# EAGLE design pihat (EAGLE 7.7.0)
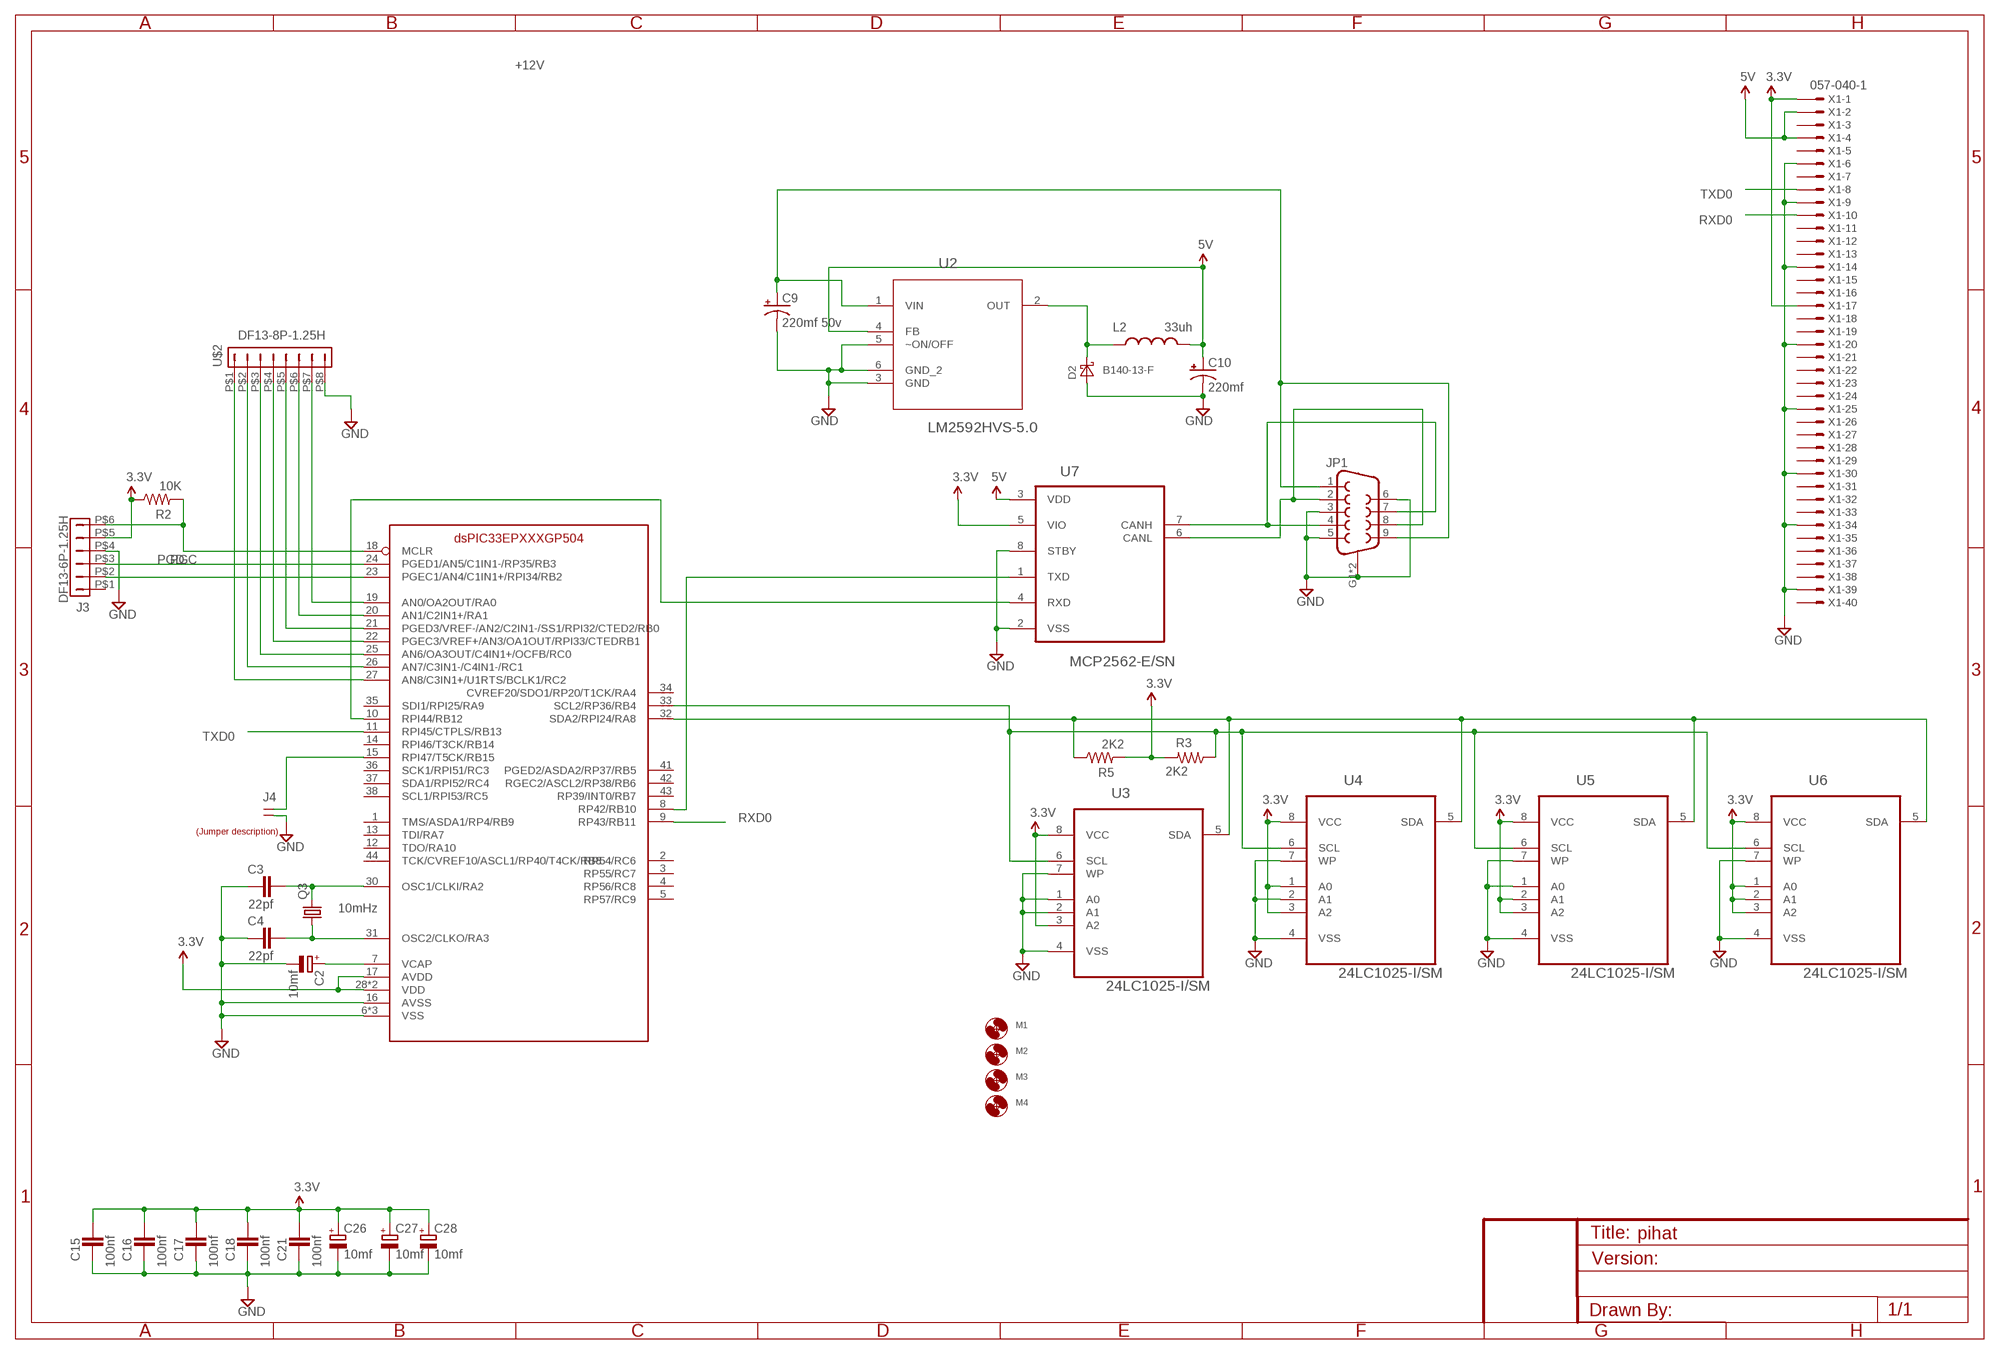
[diagram p0: schematic, sheet 1]

## Parts
C2  10mf  CAPACITOR_POL-SMC_A  [SMC_A]
C3  22pf  CAPACITOR_NPOL-0805  [C805]
C4  22pf  CAPACITOR_NPOL-0805  [C805]
C9  220mf 50v  CAP_POL7343  [EIA7343]
C10  220mf  CAP_POL7343  [EIA7343]
C15  100nf  CAPACITOR_NPOL-0805  [C805]
C16  100nf  CAPACITOR_NPOL-0805  [C805]
C17  100nf  CAPACITOR_NPOL-0805  [C805]
C18  100nf  CAPACITOR_NPOL-0805  [C805]
C21  100nf  CAPACITOR_NPOL-0805  [C805]
C26  10mf  CAPACITOR_POL-SMC_A  [SMC_A]
C27  10mf  CAPACITOR_POL-SMC_A  [SMC_A]
C28  10mf  CAPACITOR_POL-SMC_A  [SMC_A]
D2  B140-13-F  DIODE-SCHOTTKY-SMA  [SMA]
J3  DF13-6P-1.25H  [DF13A-6P-1.25H]
J4  JUMPER-1X2  [JUMPER-1X2]
JP1  DB9MALE  [DB9_MALE]
L2  33uh  INDUCTOR  [1812]
M1  MOUNT-HOLE2.8  [2,8]
M2  MOUNT-HOLE2.8  [2,8]
M3  MOUNT-HOLE2.8  [2,8]
M4  MOUNT-HOLE2.8  [2,8]
Q3  10mHz  CRYSTALHC49S  [HC49/S]
R2  10K  RESISTOR0603-RES  [0603-RES]
R3  2K2  RESISTOR0603-RES  [0603-RES]
R5  2K2  RESISTOR0603-RES  [0603-RES]
U1  DSPIC33EPXXXGP504  [TQFP44]
U2  LM2592HVS-5.0  [TO170P1435X457-5N]
U3  24LC1025-I/SM  [SOIC8-N_MC]
U4  24LC1025-I/SM  [SOIC8-N_MC]
U5  24LC1025-I/SM  [SOIC8-N_MC]
U6  24LC1025-I/SM  [SOIC8-N_MC]
U7  MCP2562-E/SN  [SOIC-8N]
U$1  LABEL_JUMPER_1X2  [JUMP2_DESC]
U$2  DF13-8P-1.25H  [DF13A-8P-1.25H]
X1  057-040-1  [057-040-1]

## Nets
3.3V: C15.1 C16.1 C17.1 C18.1 C21.1 C26.+ C27.+ C28.+ J3.P$5 R2.1 R3.2 R5.2 U1.17(AVDD) U1.28(VDD) U1.40(VDD) U3.3(A2) U3.8(VCC) U4.1(A0) U4.3(A2) U4.8(VCC) U5.2(A1) U5.3(A2) U5.8(VCC) U6.1(A0) U6.2(A1) U6.3(A2) U6.8(VCC) U7.5(VIO) X1.1 X1.17
5V: C10.A(+) L2.2 U2.4(FB) U7.3(VDD) X1.2 X1.4
!MCLR: J3.P$6 R2.2 U1.18(MCLR)
+12V [12v]: C9.A(+) JP1.1 JP1.9 U2.1(VIN)
CANH: JP1.4 JP1.7 U7.7(CANH)
CANL: JP1.2 JP1.8 U7.6(CANL)
GND: C2.- C3.2 C4.2 C9.C(-) C10.C(-) C15.2 C16.2 C17.2 C18.2 C21.2 C26.- C27.- C28.- D2.A J3.P$4 J4.2 JP1.3 JP1.5 JP1.6 JP1.G1(SHIELD) JP1.G2(SHIELD) U1.6(VSS) U1.16(AVSS) U1.29(VSS) U1.39(VSS) U2.3(GND) U2.5(~ON/OFF) U2.6(GND_2) U3.1(A0) U3.2(A1) U3.4(VSS) U3.7(WP) U4.2(A1) U4.4(VSS) U4.7(WP) U5.1(A0) U5.4(VSS) U5.7(WP) U6.4(VSS) U6.7(WP) U7.2(VSS) U7.8(STBY) U$2.P$8 X1.6 X1.9 X1.14 X1.20 X1.25 X1.30 X1.34 X1.39
N$3: U1.19(AN0/OA2OUT/RA0) U$2.P$7
N$4: U1.20(AN1/C2IN1+/RA1) U$2.P$6
N$5: U1.21(PGED3/VREF-/AN2/C2IN1-/SS1/RPI32/CTED2/RB0) U$2.P$5
N$6: U1.22(PGEC3/VREF+/AN3/OA1OUT/RPI33/CTEDRB1) U$2.P$4
N$7: U1.25(AN6/OA3OUT/C4IN1+/OCFB/RC0) U$2.P$3
N$8: U1.26(AN7/C3IN1-/C4IN1-/RC1) U$2.P$2
N$9: U1.27(AN8/C3IN1+/U1RTS/BCLK1/RC2) U$2.P$1
N$12: D2.C L2.1 U2.2(OUT)
N$19: C3.1 Q3.2 U1.30(OSC1/CLKI/RA2)
N$24: U1.10(RPI44/RB12) U7.4(RXD)
N$25: C2.+ U1.7(VCAP)
N$26: U1.8(RP42/RB10) U7.1(TXD)
N$70: C4.1 Q3.1 U1.31(OSC2/CLKO/RA3)
PGC: J3.P$2 U1.23(PGEC1/AN4/C1IN1+/RPI34/RB2)
PGD: J3.P$3 U1.24(PGED1/AN5/C1IN1-/RP35/RB3)
RESET#: J4.1 U1.15(RPI47/T5CK/RB15)
RXD0: U1.9(RP43/RB11) X1.10
SCL: R3.1 U1.33(SCL2/RP36/RB4) U3.6(SCL) U4.6(SCL) U5.6(SCL) U6.6(SCL)
SDA: R5.1 U1.32(SDA2/RPI24/RA8) U3.5(SDA) U4.5(SDA) U5.5(SDA) U6.5(SDA)
TXD0: U1.11(RPI45/CTPLS/RB13) X1.8
Unconnected: J3.P$1 U1.1(TMS/ASDA1/RP4/RB9) U1.2(RP54/RC6) U1.3(RP55/RC7) U1.4(RP56/RC8) U1.5(RP57/RC9) U1.12(TDO/RA10) U1.13(TDI/RA7) U1.14(RPI46/T3CK/RB14) U1.34(CVREF20/SDO1/RP20/T1CK/RA4) U1.35(SDI1/RPI25/RA9) U1.36(SCK1/RPI51/RC3) U1.37(SDA1/RPI52/RC4) U1.38(SCL1/RPI53/RC5) U1.41(PGED2/ASDA2/RP37/RB5) U1.42(RGEC2/ASCL2/RP38/RB6) U1.43(RP39/INT0/RB7) U1.44(TCK/CVREF10/ASCL1/RP40/T4CK/RB8) X1.3 X1.5 X1.7 X1.11 X1.12 X1.13 X1.15 X1.16 X1.18 X1.19 X1.21 X1.22 X1.23 X1.24 X1.26 X1.27 X1.28 X1.29 X1.31 X1.32 X1.33 X1.35 X1.36 X1.37 X1.38 X1.40

## Library data of the parts
C2 C26-C28 = dp_devices:CAPACITOR_POL: Polarized capacitor in various packages; PARTNO: T491A106K004AT
C3 C4 = dp_devices:CAPACITOR_NPOL: Non-Polarized capacitor in various packages; PARTNO: C0805C220J5GACTU
C9 C10 = SparkFun:CAP_POL: Capacitor Polarized These are standard SMD and PTH capacitors. Normally 10uF, 47uF, and 100uF in electrolytic and tantalum varieties. Always verify the external diameter of the through hole cap, it varies with capacity, voltage, and manufacturer. The EIA devices should be standard.
C15-C18 C21 = dp_devices:CAPACITOR_NPOL: Non-Polarized capacitor in various packages; PARTNO: CL21F104ZBCNNNC
D2 = diode2:DIODE-SCHOTTKY-: SCHOTTKY DIODE
J3 = con-hirose-df13:DF13-6P-1.25: DF13-6P 1.25mm Pitch Miniature Crimping Connector.; PARTNO: DF13A-6P-1.25H(20)
J4 = QuantumOptics:JUMPER-1X2: Jumper, header, SIP on 0.1" grid, for option selection.; PARTNO: M20-9770246
JP1 = 15pinD:DB9: DB9 Connector Standard DB9 (D-Sub 9) serial connector. Can be used for CAN bus as well as RS485 and RS232. Footprint production proven. Spark Fun Electronics SKU : PRT-00429; PROD_ID: CONN-09904
L2 = SparkFun:INDUCTOR: Inductors Basic Inductor/Choke - 0603 and 1206. Footprints are not proven and vary greatly between part numbers.
M1-M4 = tdk:MOUNT-HOLE: MOUNTING HOLE with drill center marker
Q3 = crystal:CRYSTAL: CRYSTAL; OC_FARNELL: 1667008; OC_NEWARK: unknown; PARTNO: ATS100B-E
R2 = SparkFun-Passives:RESISTOR: Resistor Basic schematic elements and footprints for 0603, 1206, and PTH resistors.; PARTNO: RC0603FR-0710KL
R3 R5 = SparkFun-Passives:RESISTOR: Resistor Basic schematic elements and footprints for 0603, 1206, and PTH resistors.; PARTNO: RC0603FR-072K2L
U1 = microchip-dspic:DSPIC33EPXXXGP504; PARTNO: DSPIC33EP512GP504-I/PT
U2 = NSC_By_element14_Batch_1.1:LM2592HVS-5.0: SIMPLE SWITCHER; MPN: LM2592HVS-5.0; OC_FARNELL: -; OC_NEWARK: 41K3791; PACKAGE: TO-263-5; SUPPLIER: National Semiconductor
U3-U6 = Microchip_By_element14_Batch_1:24LC1025-I/SM: 1024K I2C CMOS Serial EEPROM; PARTNO: 24LC1025T-I/SN
U7 = Microchip-MCP2562-E_SN:MCP2562-E/SN: High-Speed CAN Transceiver,SOIC-8; PARTNO: MCP2562-E/SN
U$1 = dp_devices:LABEL_JUMPER_1X2: Nice formatted two legged jumperdescription Use attributes to change the values ON = With jumper OFF = Without jumper; OFF: Normal; ON: Reset
U$2 = con-hirose-df13:DF13-8P-1.25: DF13-8P 1.25mm Pitch Miniature Crimping Connector.
X1 = con-panduit-changed:057-040-: CONNECTOR 40-pin series 057 contact pc board low profile headers; OC_FARNELL: unknown; OC_NEWARK: unknown

## Net classes
2 12v: width 0.152 mm, drill 0.305 mm, clearance 0.305 mm

## Board
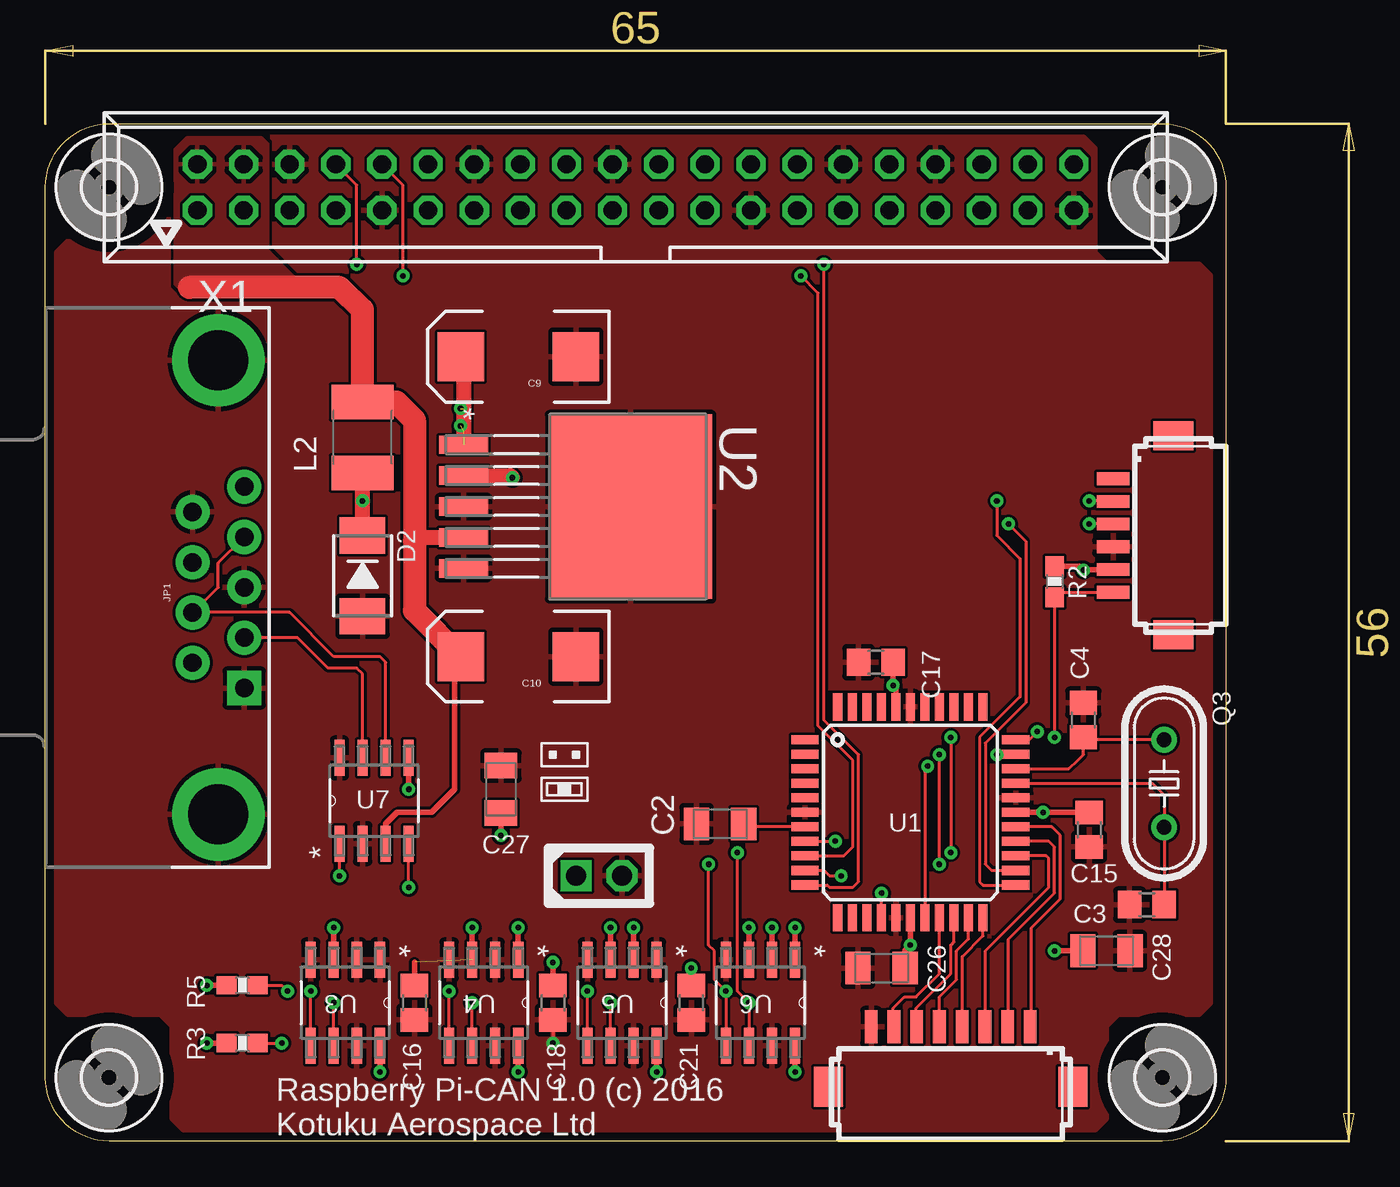
[diagram p1: board, top side]
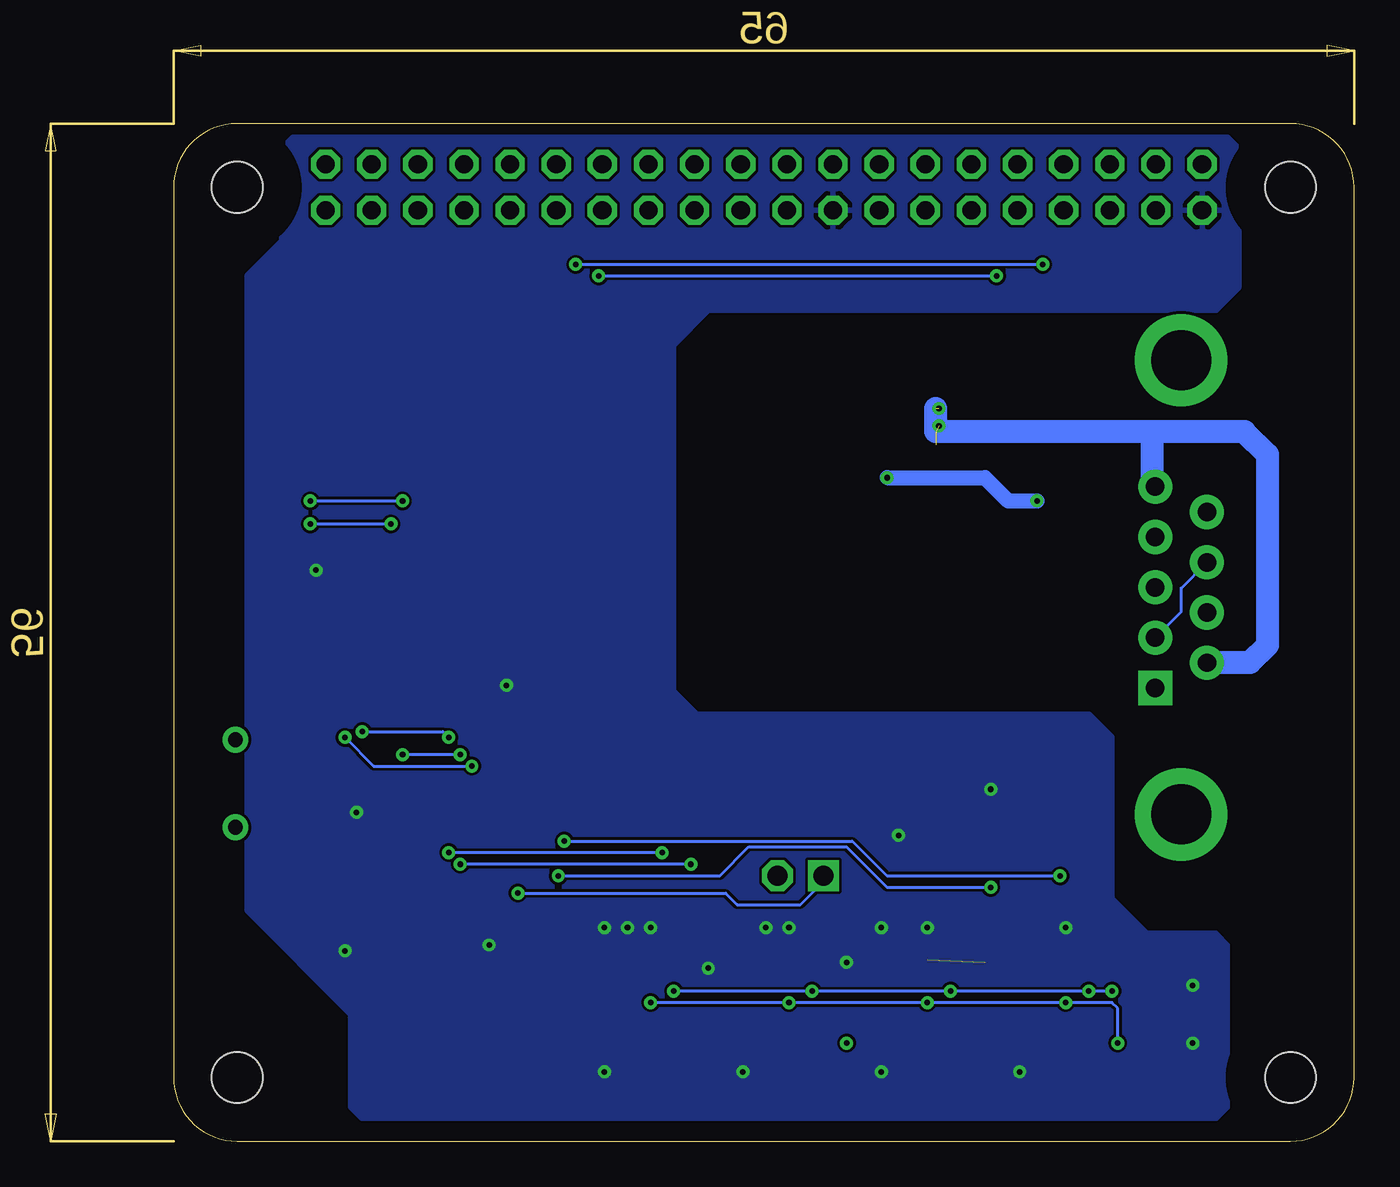
[diagram p2: board, bottom side, seen from below]

Size 65 x 56 mm. Coordinates in mm from the lower left corner, seen from the top.
Outline: 0,3.5 0,52.5 arc-90 3.5,56 61.5,56 arc-90 65,52.5 65,3.5 arc-90 61.5,0 3.5,0 arc-90 0,3.5
Copper layers (1*16): Top 0.035mm / dielectric 1.5mm / Bottom 0.035mm
Design rules "DFRobot_Eagle_Rule_v0.4": minimum track width 6mil, minimum drill 12mil, track to track 6mil, track to pad 6mil, pad to pad 6mil, via to via 6mil, smd to smd 0mil, copper to edge 10mil, drill to drill 10mil, minimum pad ring 12mil, minimum via ring 8mil, stop-mask expansion 2mil, vias tented up to drill 25mil, thermal gap 10mil

### Footprints (pad centres in the part's own frame; a part is rotated, then mirrored left to right if it is on the bottom)
SMC_A = smd 1.4 x 1.8: + -1.3,0; - 1.3,0
C805 = smd 1.3 x 1.5: 1 -0.95,0; 2 0.95,0
EIA7343 = smd 2.55 x 2.7: A 3.17,0; C -3.17,0
SMA = smd 2 x 2.5: A 2.223,0; C -2.223,0
DF13A-6P-1.25H = smd 1.6 x 2.2: M$0 -5.475,2.4; M$1 5.475,2.4 | smd 0.7 x 1.8: P$1 -3.125,-0.9; P$2 -1.875,-0.9; P$3 -0.625,-0.9; P$4 0.625,-0.9; P$5 1.875,-0.9; P$6 3.125,-0.9
JUMPER-1X2 = drill 1.092 square: 1 0,2.54 | drill 1.092 octagon: 2 0,0
DB9_MALE = drill 1.016 pad 1.88: 1 5.54,-1.42; 2 2.77,-1.42; 3 0,-1.42; 4 -2.77,-1.42; 6 4.15,1.42; 7 1.38,1.42; 8 -1.38,1.42; 9 -4.15,1.42 | drill 1.016 pad 1.88 square: 5 -5.54,-1.42 | drill 3.302 pad 5.08: G1 -12.5,0; G2 12.5,0
1812 = smd 1.9 x 3.4: 1 -1.95,0; 2 1.95,0
2,8 = hole 2.8: 0,0
HC49/S = drill 0.813: 1 -2.413,0; 2 2.413,0
0603-RES = smd 1.1 x 1: 1 -0.85,0; 2 0.85,0
TQFP44 = smd 1.5 x 0.5: 1 -5.8,4; 2 -5.8,3.2; 3 -5.8,2.4; 4 -5.8,1.6; 5 -5.8,0.8; 6 -5.8,0; 7 -5.8,-0.8; 8 -5.8,-1.6; 9 -5.8,-2.4; 10 -5.8,-3.2; 11 -5.8,-4; 23 5.8,-4; 24 5.8,-3.2; 25 5.8,-2.4; 26 5.8,-1.6; 27 5.8,-0.8; 28 5.8,0; 29 5.8,0.8; 30 5.8,1.6; 31 5.8,2.4; 32 5.8,3.2; 33 5.8,4 | smd 0.5 x 1.5: 12 -4,-5.8; 13 -3.2,-5.8; 14 -2.4,-5.8; 15 -1.6,-5.8; 16 -0.8,-5.8; 17 0,-5.8; 18 0.8,-5.8; 19 1.6,-5.8; 20 2.4,-5.8; 21 3.2,-5.8; 22 4,-5.8; 34 4,5.8; 35 3.2,5.8; 36 2.4,5.8; 37 1.6,5.8; 38 0.8,5.8; 39 0,5.8; 40 -0.8,5.8; 41 -1.6,5.8; 42 -2.4,5.8; 43 -3.2,5.8; 44 -4,5.8
TO170P1435X457-5N = smd 1.016 x 2.692: 1 -3.404,-9.042; 2 -1.702,-9.042; 3 0,-9.042; 4 1.702,-9.042; 5 3.404,-9.042 | smd 10.16 x 8.941: 6 0,0.152
SOIC8-N_MC = smd 1.981 x 0.559: 1 -2.362,1.905; 2 -2.362,0.635; 3 -2.362,-0.635; 4 -2.362,-1.905; 5 2.362,-1.905; 6 2.362,-0.635; 7 2.362,0.635; 8 2.362,1.905
SOIC-8N = smd 1.981 x 0.559: 1 1.448,5.715; 2 1.448,4.445; 3 1.448,3.175; 4 1.448,1.905; 5 6.172,1.905; 6 6.172,3.175; 7 6.172,4.445; 8 6.172,5.715
DF13A-8P-1.25H = smd 1.6 x 2.2: M$0 -6.725,2.4; M$1 6.725,2.4 | smd 0.7 x 1.8: P$1 -4.375,-0.9; P$2 -3.125,-0.9; P$3 -1.875,-0.9; P$4 -0.625,-0.9; P$5 0.625,-0.9; P$6 1.875,-0.9; P$7 3.125,-0.9; P$8 4.375,-0.9
057-040-1 = drill 1 octagon: 1 -24.13,-1.27; 2 -24.13,1.27; 3 -21.59,-1.27; 4 -21.59,1.27; 5 -19.05,-1.27; 6 -19.05,1.27; 7 -16.51,-1.27; 8 -16.51,1.27; 9 -13.97,-1.27; 10 -13.97,1.27; 11 -11.43,-1.27; 12 -11.43,1.27; 13 -8.89,-1.27; 14 -8.89,1.27; 15 -6.35,-1.27; 16 -6.35,1.27; 17 -3.81,-1.27; 18 -3.81,1.27; 19 -1.27,-1.27; 20 -1.27,1.27; 21 1.27,-1.27; 22 1.27,1.27; 23 3.81,-1.27; 24 3.81,1.27; 25 6.35,-1.27; 26 6.35,1.27; 27 8.89,-1.27; 28 8.89,1.27; 29 11.43,-1.27; 30 11.43,1.27; 31 13.97,-1.27; 32 13.97,1.27; 33 16.51,-1.27; 34 16.51,1.27; 35 19.05,-1.27; 36 19.05,1.27; 37 21.59,-1.27; 38 21.59,1.27; 39 24.13,-1.27; 40 24.13,1.27

### Placement (x,y rotation side)
C2  37.15,17.46 180 top
C3  60.64,13.02 180 top
C4  57.15,23.18 90 top
C9  26.04,43.18 180 top
C10  26.04,26.67 180 top
C15  57.47,17.14 270 top
C16  20.32,7.62 270 top
C17  45.72,26.35 180 top
C18  27.94,7.62 270 top
C21  35.56,7.62 270 top
C26  46.04,9.53 180 top
C27  25.08,19.37 90 top
C28  58.42,10.48 0 top
D2  17.46,31.11 270 top
J3  59.69,33.34 270 top
J4  31.75,14.61 90 top
JP1  9.53,30.48 90 top
L2  17.46,38.73 90 top
M1  3.5,3.5 0 top
M2  3.5,52.5 0 top
M3  61.5,3.5 0 top
M4  61.5,52.5 0 top
Q3  61.59,19.68 270 top
R2  55.56,30.8 270 top
R3  10.84,5.4 180 top
R5  10.84,8.57 180 top
U1  47.62,18.1 0 top
U2  32.07,34.92 270 top
U3  16.51,7.62 270 top
U4  24.13,7.62 270 top
U5  31.75,7.62 270 top
U6  39.37,7.62 270 top
U7  21.91,14.92 90 top
U$1  31.11,20 0 top
U$2  49.85,5.4 180 top
X1  32.5,52.5 0 top

### Tracks (layer width: path | path; a pad name or v marks a point on that pad's centre or on a via)
3.3V  (via drill 0.3)  (1 unrouted)
  Top 0.305: U7.5 v20,19.37 | C27.+ v25.08,16.83 | U4.1 v26.04,11.75 | U4.3 v23.5,11.75 | U3.3 v15.88,11.75 | R3.2 v8.89,5.4 | R5.2 v8.89,8.57 | U3.8 v18.41,3.81 | C16.1 20.32,9.84 | C18.1 v27.94,9.84 | U4.8 v26.04,3.81 | U5.8 v33.66,3.81 | U5.3 v31.11,11.75 | U5.2 v32.38,11.75 | C21.1 v35.56,9.53 | U6.3 v38.73,11.75 | U6.2 v40.01,11.75 | U6.1 v41.27,11.75 | U6.8 v41.27,3.81 | J3.P$5 57.18,31.46 v57.15,31.43 56.94,31.65 R2.1 | C17.1 v46.67,25.08 46.83,24.93 U1.40 | U1.28 v54.93,18.1 C15.1 | U1.17 v47.62,10.79 47.34,10.51 C26.+ | C28.+ v55.56,10.48
  pour Bottom: 6.99,55.24 6.35,54.61 6.35,46.99 7.62,45.72 35.56,45.72 37.47,43.81 37.47,24.77 36.2,23.5 14.61,23.5 13.34,22.23 13.34,13.34 11.43,11.43 7.62,11.43 6.99,10.79 6.99,1.91 7.62,1.27 54.61,1.27 55.24,1.91 55.24,6.99 60.96,12.7 60.96,47.62 59.05,49.53 59.05,54.61 58.42,55.24
5V
  Top 0.305: C10.A 22.54,26.35 22.54,19.37 21.27,18.1 19.37,18.1 18.73,17.46 U7.3
  Top 0.813: U2.4 20.32,33.22 20.32,33.02
  Top 1.27: 7.94,46.99 16.19,46.99 17.46,45.77 L2.2 19.32,40.69 20.32,39.69 20.32,33.02 20.32,29.21 C10.A
  pour Top: 7.14,54.61 7.78,55.24 9.37,55.24 11.91,55.24 12.22,54.93 12.22,49.05 13.65,47.62 13.65,46.67 7.62,46.67 7.14,47.15
!MCLR  (via drill 0.3)
  Top 0.152: J3.P$6 55.83,30.21 R2.2 v55.56,22.23 | U1.18 48.42,20.48 v48.58,20.64
  Bottom 0.152: v55.56,22.23 53.98,20.64 v48.58,20.64
+12V  (via drill 0.3)  (3 unrouted)
  Top 0.813: C9.A 23.02,43.18 U2.1
  Bottom 1.27: 11.11,39.05 23.02,39.05 23.02,40.32 | JP1.1 11.11,36.19 11.11,39.05 | JP1.9 8.08,26.35 5.71,26.35 4.76,27.3 4.76,37.78 6.03,39.05 11.11,39.05
  other vias: 22.86,40.32 22.86,39.37
CANH
  Top 0.152: U7.7 17.46,25.72 17.14,26.04 15.56,26.04 13.88,27.71 JP1.4
  Bottom 0.152: JP1.4 9.53,29.13 9.53,30.44 JP1.7
CANL
  Top 0.152: U7.6 18.73,26.35 18.41,26.67 15.88,26.67 13.45,29.1 JP1.8 8.14,29.1 9.53,30.48 9.53,31.83 JP1.2
GND  (via drill 0.3)
  Top 0.152: C18.2 v27.94,5.4
  pour Top (rank 2): 12.7,55.24 6.35,55.24 5.71,54.61 5.71,50.16 5.08,49.53 1.27,49.53 0.64,48.9 0.64,7.62 1.27,6.99 6.35,6.99 6.99,6.35 6.99,1.27 7.62,0.64 57.78,0.64 58.42,1.27 58.42,6.35 59.05,6.99 63.5,6.99 64.14,7.62 64.14,47.62 63.5,48.26 58.42,48.26 57.78,48.9 57.78,54.61 57.15,55.24
N$3
  Top 0.152: U$2.P$7 46.67,6.35 46.67,7.3 47.31,7.94 47.94,7.94 49.23,9.22 U1.19
N$4
  Top 0.152: U$2.P$6 47.94,6.33 47.94,7.3 49.85,9.21 49.85,10.79 50.02,10.97 U1.20
N$5
  Top 0.152: U$2.P$5 49.21,7.94 50.16,8.89 50.16,10.48 50.83,11.14 U1.21
N$6
  Top 0.152: U$2.P$4 50.48,6.31 50.48,10.16 51.62,11.3 U1.22
N$7
  Top 0.152: U$2.P$3 51.75,6.33 51.75,10.48 55.24,13.97 55.24,15.56 55.1,15.7 U1.25
N$8
  Top 0.152: U$2.P$2 53.02,6.35 53.02,11.11 55.56,13.65 55.56,16.19 55.26,16.5 U1.26
N$9
  Top 0.152: U$2.P$1 54.29,6.37 54.29,11.75 55.88,13.34 55.88,16.83 55.41,17.3 U1.27
N$12  (via drill 0.3)
  Top 0.813: U2.2 25.6,36.63 v25.72,36.51 | L2.1 v17.46,35.24 D2.C
  Bottom 0.813: v25.72,36.51 20.32,36.51 19.05,35.24 v17.46,35.24
N$19
  Top 0.152: U1.30 60.95,19.7 61.59,19.05 Q3.2 C3.1
N$24  (via drill 0.3)
  Top 0.152: U1.10 41.85,14.92 42.86,14.92 43.18,14.61 v43.81,14.61 | v20,13.97 U7.4
  Bottom 0.152: v43.81,14.61 34.92,14.61 33.34,16.19 27.94,16.19 25.72,13.97 v20,13.97
N$25
  Top 0.152: U1.7 38.61,17.3 C2.+
N$26  (via drill 0.3)
  Top 0.152: U1.8 v43.5,16.51 | v16.19,14.61 U7.1
  Bottom 0.152: v43.5,16.51 27.62,16.51 25.72,14.61 v16.19,14.61
N$70
  Top 0.152: U1.31 56.34,20.5 56.83,20.95 57.15,21.27 C4.1 57.28,22.1 Q3.1
PGC  (via drill 0.3)
  Top 0.152: J3.P$2 58.76,35.24 v57.47,35.24 | v52.39,35.24 52.39,33.34 53.66,32.07 53.66,24.45 51.44,22.23 51.44,14.29 51.62,14.1 U1.23
  Bottom 0.152: v57.47,35.24 v52.39,35.24
PGD  (via drill 0.3)
  Top 0.152: J3.P$3 58.78,33.97 v57.47,33.97 | v53.02,33.97 53.98,33.02 53.98,24.13 51.75,21.91 51.75,15.24 52.09,14.9 U1.24
  Bottom 0.152: v57.47,33.97 v53.02,33.97
RESET#  (via drill 0.3)
  Top 0.152: U1.15 46.04,12.31 v46.04,13.65
  Bottom 0.152: v46.04,13.65 34.61,13.65 33.97,13.02 30.48,13.02 29.21,14.29 J4.1
RXD0  (via drill 0.3)
  Top 0.152: U1.9 43.95,15.7 44.45,16.19 44.45,20.95 42.55,22.86 42.55,46.67 v41.59,47.62 | v19.68,47.62 19.68,52.62 X1.10
  Bottom 0.152: v41.59,47.62 v19.68,47.62
SCL  (via drill 0.3)
  Top 0.152: U3.6 v15.88,7.62 | U6.6 v38.73,7.62 38.1,8.26 v38.1,15.88 | U4.6 v23.5,7.62 | U5.6 v31.11,7.62 | R3.1 v13.02,5.4 | U1.33 54.16,22.1 v54.61,22.54 | v49.85,22.23 v49.85,15.88
  Bottom 0.152: v38.73,7.62 v31.11,7.62 v23.5,7.62 v15.88,7.62 13.34,7.62 13.02,7.3 v13.02,5.4 | v38.1,15.88 v49.85,15.88 | v54.61,22.54 50.16,22.54 v49.85,22.23
SDA  (via drill 0.3)
  Top 0.152: U3.5 v14.61,8.26 | U6.5 v37.47,8.26 36.83,8.89 36.83,10.48 36.51,10.79 v36.51,15.24 | U5.5 v29.84,8.26 | U4.5 v22.23,8.26 | R5.1 13.02,8.57 v13.34,8.26 | v49.21,15.24 v49.21,21.27 | v52.39,21.27 53.4,21.27 U1.32
  Bottom 0.152: v37.47,8.26 v29.84,8.26 v22.23,8.26 v14.61,8.26 v13.34,8.26 | v36.51,15.24 v49.21,15.24 | v49.21,21.27 v52.39,21.27
TXD0  (via drill 0.3)
  Top 0.152: U1.11 43.05,14.1 43.18,13.97 44.45,13.97 44.77,14.29 44.77,21.27 42.86,23.18 v42.86,48.26 | v17.14,48.26 17.14,52.62 X1.8
  Bottom 0.152: v42.86,48.26 v17.14,48.26

### Text on the board
tPlace: Raspberry Pi-CAN 1.0 (c) 2016 | Kotuku Aerospace Ltd